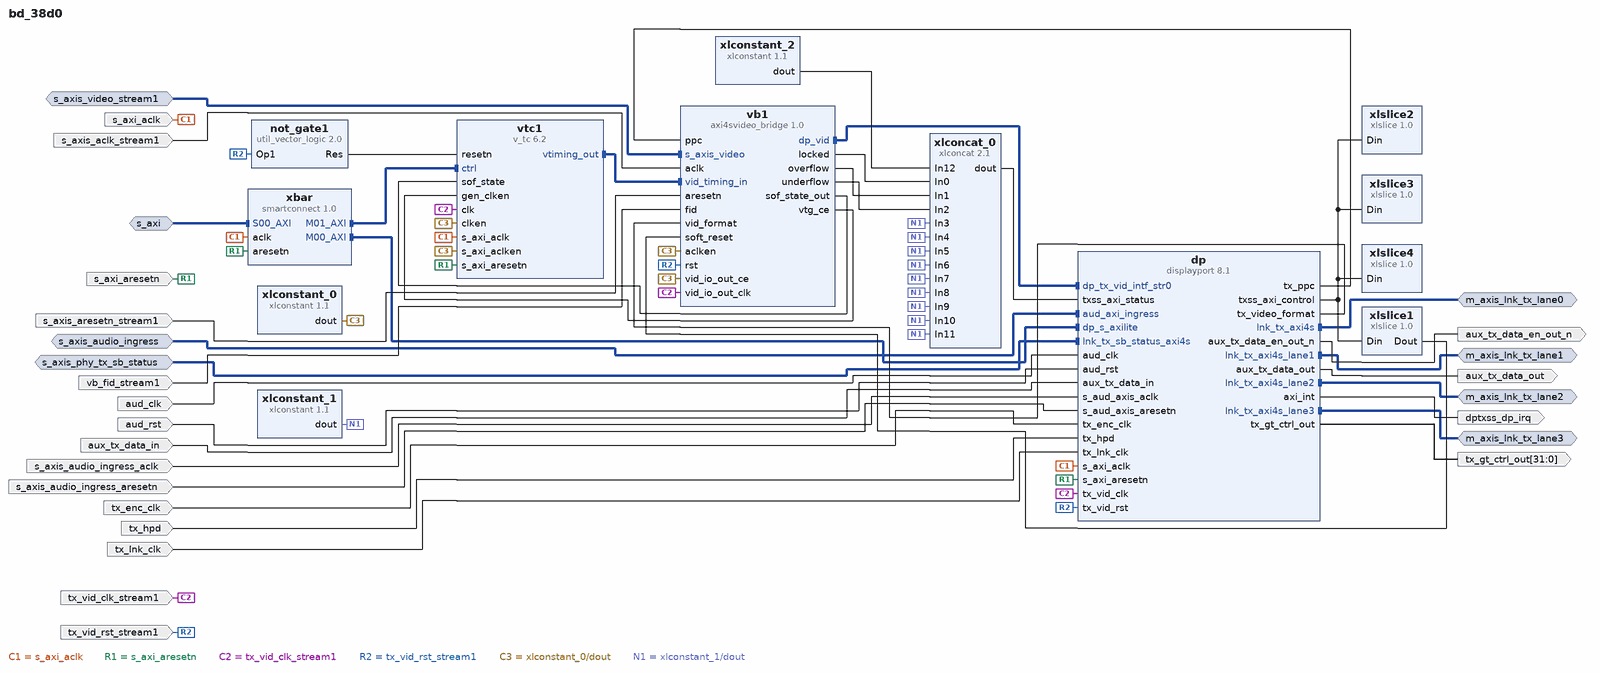
[diagram p0: block diagram of the top level]
# Vivado block design bd_38d0, xcvc1902-vsva2197-2MP-e-S, Vivado 2023.2
create_bd_design bd_38d0

create_bd_intf_port -mode Slave -vlnv xilinx.com:interface:aximm_rtl:1.0 s_axi
set_property -dict [list \
  CONFIG.ADDR_WIDTH 16 \
  CONFIG.DATA_WIDTH 32 \
  CONFIG.NUM_READ_OUTSTANDING 1 \
  CONFIG.NUM_WRITE_OUTSTANDING 1 \
  CONFIG.PROTOCOL AXI4LITE \
  CONFIG.master_id 1 \
] [get_bd_intf_ports s_axi]
create_bd_intf_port -mode Slave -vlnv xilinx.com:interface:axis_rtl:1.0 s_axis_video_stream1
set_property -dict {CONFIG.HAS_TLAST 1 CONFIG.TDATA_NUM_BYTES 15} [get_bd_intf_ports s_axis_video_stream1]
create_bd_intf_port -mode Slave -vlnv xilinx.com:interface:axis_rtl:1.0 s_axis_phy_tx_sb_status
create_bd_intf_port -mode Master -vlnv xilinx.com:interface:axis_rtl:1.0 m_axis_lnk_tx_lane0
create_bd_intf_port -mode Master -vlnv xilinx.com:interface:axis_rtl:1.0 m_axis_lnk_tx_lane1
create_bd_intf_port -mode Master -vlnv xilinx.com:interface:axis_rtl:1.0 m_axis_lnk_tx_lane2
create_bd_intf_port -mode Master -vlnv xilinx.com:interface:axis_rtl:1.0 m_axis_lnk_tx_lane3
create_bd_intf_port -mode Slave -vlnv xilinx.com:interface:axis_rtl:1.0 s_axis_audio_ingress
set_property -dict {CONFIG.HAS_TLAST 1 CONFIG.TDATA_NUM_BYTES 4} [get_bd_intf_ports s_axis_audio_ingress]
create_bd_port -dir I aux_tx_data_in
create_bd_port -dir O aux_tx_data_out
create_bd_port -dir O aux_tx_data_en_out_n
create_bd_port -dir I -type data tx_hpd
create_bd_port -dir O -type intr dptxss_dp_irq
create_bd_port -dir O -from 31 -to 0 tx_gt_ctrl_out
create_bd_port -dir I vb_fid_stream1
create_bd_port -dir I -type clk s_axi_aclk
set_property -dict [list \
  CONFIG.ASSOCIATED_BUSIF s_axi:s_axis_phy_tx_sb_status \
  CONFIG.ASSOCIATED_RESET s_axi_aresetn \
] [get_bd_ports s_axi_aclk]
create_bd_port -dir I -type rst s_axi_aresetn
set_property -dict {CONFIG.POLARITY ACTIVE_LOW} [get_bd_ports s_axi_aresetn]
create_bd_port -dir I -type clk s_axis_aclk_stream1
set_property -dict [list \
  CONFIG.ASSOCIATED_BUSIF s_axis_video_stream1 \
  CONFIG.ASSOCIATED_RESET s_axis_aresetn_stream1 \
] [get_bd_ports s_axis_aclk_stream1]
create_bd_port -dir I -type rst s_axis_aresetn_stream1
set_property -dict {CONFIG.POLARITY ACTIVE_LOW} [get_bd_ports s_axis_aresetn_stream1]
create_bd_port -dir I -type clk tx_vid_clk_stream1
set_property -dict {CONFIG.ASSOCIATED_RESET tx_vid_rst_stream1} [get_bd_ports tx_vid_clk_stream1]
create_bd_port -dir I -type rst tx_vid_rst_stream1
set_property -dict {CONFIG.POLARITY ACTIVE_HIGH} [get_bd_ports tx_vid_rst_stream1]
create_bd_port -dir I -type clk tx_enc_clk
create_bd_port -dir I -type clk tx_lnk_clk
set_property -dict [list \
  CONFIG.ASSOCIATED_BUSIF m_axis_lnk_tx_lane0:m_axis_lnk_tx_lane1:m_axis_lnk_tx_lane2:m_axis_lnk_tx_lane3 \
] [get_bd_ports tx_lnk_clk]
create_bd_port -dir I aud_clk
create_bd_port -dir I aud_rst
create_bd_port -dir I -type clk s_axis_audio_ingress_aclk
set_property -dict [list \
  CONFIG.ASSOCIATED_BUSIF s_axis_audio_ingress \
  CONFIG.ASSOCIATED_RESET s_axis_audio_ingress_aresetn \
] [get_bd_ports s_axis_audio_ingress_aclk]
create_bd_port -dir I -type rst s_axis_audio_ingress_aresetn
set_property -dict {CONFIG.POLARITY ACTIVE_LOW} [get_bd_ports s_axis_audio_ingress_aresetn]

create_bd_cell -type ip -vlnv xilinx.com:ip:displayport:8.1 dp
set_property -dict [list \
  CONFIG.C_VERSAL true \
  CONFIG.ENABLE_8B10B_ENC true \
  CONFIG.Enable_HDCP22_Encryption_Hooks false \
  CONFIG.Enable_HDCP_Encryption_Hooks false \
  CONFIG.Enable_of_Audio_Channels true \
  CONFIG.GT_Data_Width 2 \
  CONFIG.Link_Rate 8.1 \
  CONFIG.MST_Enable false \
  CONFIG.Max_Bits_Per_Color 10 \
  CONFIG.Number_of_Audio_Channels 2 \
  CONFIG.Number_of_Lanes 4 \
  CONFIG.PHY_type_External External_phy \
  CONFIG.Protocol_Selection DP_1_3 \
  CONFIG.Quad_Pixel_Enable true \
  CONFIG.SIM_Mode false \
  CONFIG.SS_Mode true \
  CONFIG.YCRCB_Enable true \
  CONFIG.YOnly_Enable true \
  CONFIG.YUV420_ENABLE 0 \
  CONFIG.aux_io_loc 1 \
  CONFIG.aux_io_type 0 \
  CONFIG.eDP_Enable false \
] [get_bd_cells dp]
create_bd_cell -type ip -vlnv xilinx.com:ip:xlconstant:1.1 xlconstant_1
set_property -dict {CONFIG.CONST_VAL 0} [get_bd_cells xlconstant_1]
create_bd_cell -type ip -vlnv xilinx.com:ip:xlconcat:2.1 xlconcat_0
set_property -dict {CONFIG.IN12_WIDTH 20 CONFIG.NUM_PORTS 13} [get_bd_cells xlconcat_0]
create_bd_cell -type ip -vlnv xilinx.com:ip:xlconstant:1.1 xlconstant_0
create_bd_cell -type ip -vlnv xilinx.com:ip:xlconstant:1.1 xlconstant_2
set_property -dict {CONFIG.CONST_VAL 0 CONFIG.CONST_WIDTH 20} [get_bd_cells xlconstant_2]
create_bd_cell -type ip -vlnv xilinx.com:ip:xlslice:1.0 xlslice1
set_property -dict {CONFIG.DIN_FROM 31 CONFIG.DIN_TO 31 CONFIG.DIN_WIDTH 32} [get_bd_cells xlslice1]
create_bd_cell -type ip -vlnv xilinx.com:ip:xlslice:1.0 xlslice2
set_property -dict {CONFIG.DIN_FROM 30 CONFIG.DIN_TO 30 CONFIG.DIN_WIDTH 32} [get_bd_cells xlslice2]
create_bd_cell -type ip -vlnv xilinx.com:ip:xlslice:1.0 xlslice3
set_property -dict {CONFIG.DIN_FROM 29 CONFIG.DIN_TO 29 CONFIG.DIN_WIDTH 32} [get_bd_cells xlslice3]
create_bd_cell -type ip -vlnv xilinx.com:ip:xlslice:1.0 xlslice4
set_property -dict {CONFIG.DIN_FROM 28 CONFIG.DIN_TO 28 CONFIG.DIN_WIDTH 32} [get_bd_cells xlslice4]
create_bd_cell -type ip -vlnv xilinx.com:ip:v_tc:6.2 vtc1
set_property -dict [list \
  CONFIG.GEN_FIELDID_EN true \
  CONFIG.GEN_FIELDID_POLARITY Low \
  CONFIG.INTERLACE_EN true \
  CONFIG.VIDEO_MODE 480p \
  CONFIG.enable_detection false \
  CONFIG.max_clocks_per_line 16384 \
  CONFIG.max_lines_per_frame 8192 \
] [get_bd_cells vtc1]
create_bd_cell -type ip -vlnv xilinx.com:ip:util_vector_logic:2.0 not_gate1
set_property -dict {CONFIG.C_OPERATION not CONFIG.C_SIZE 1} [get_bd_cells not_gate1]
create_bd_cell -type ip -vlnv xilinx.com:ip:smartconnect:1.0 xbar
set_property -dict {CONFIG.NUM_MI 2 CONFIG.NUM_SI 1} [get_bd_cells xbar]
create_bd_cell -type ip -vlnv xilinx.com:ip:axi4svideo_bridge:1.0 vb1
set_property -dict [list \
  CONFIG.pBPC 10 \
  CONFIG.pENABLE_420 0 \
  CONFIG.pENABLE_DSC false \
  CONFIG.pINPUT_PIXELS_PER_CLOCK 4 \
  CONFIG.pPIXELS_PER_CLOCK 4 \
  CONFIG.pPPC_CONVERT_EN 1 \
  CONFIG.pTDATA_NUM_BYTES 120 \
  CONFIG.pUG934_COMPLIANCE true \
] [get_bd_cells vb1]

# ---- connections ----

connect_bd_intf_net [get_bd_intf_pins dp/lnk_tx_axi4s] [get_bd_intf_ports m_axis_lnk_tx_lane0]
connect_bd_intf_net [get_bd_intf_pins dp/lnk_tx_axi4s_lane1] [get_bd_intf_ports m_axis_lnk_tx_lane1]
connect_bd_intf_net [get_bd_intf_pins dp/lnk_tx_axi4s_lane2] [get_bd_intf_ports m_axis_lnk_tx_lane2]
connect_bd_intf_net [get_bd_intf_pins dp/lnk_tx_axi4s_lane3] [get_bd_intf_ports m_axis_lnk_tx_lane3]
connect_bd_intf_net [get_bd_intf_ports s_axi] [get_bd_intf_pins xbar/S00_AXI]
connect_bd_intf_net [get_bd_intf_ports s_axis_audio_ingress] [get_bd_intf_pins dp/aud_axi_ingress]
connect_bd_intf_net [get_bd_intf_pins dp/lnk_tx_sb_status_axi4s] [get_bd_intf_ports s_axis_phy_tx_sb_status]
connect_bd_intf_net -intf_net s_axis_video_stream1_1 [get_bd_intf_ports s_axis_video_stream1] [get_bd_intf_pins vb1/s_axis_video]
connect_bd_intf_net [get_bd_intf_pins vb1/dp_vid] [get_bd_intf_pins dp/dp_tx_vid_intf_str0]
connect_bd_intf_net [get_bd_intf_pins vb1/vid_timing_in] [get_bd_intf_pins vtc1/vtiming_out]
connect_bd_intf_net [get_bd_intf_pins xbar/M00_AXI] [get_bd_intf_pins dp/dp_s_axilite]
connect_bd_intf_net [get_bd_intf_pins xbar/M01_AXI] [get_bd_intf_pins vtc1/ctrl]
connect_bd_net [get_bd_ports aud_clk] [get_bd_pins dp/aud_clk]
connect_bd_net [get_bd_ports aud_rst] [get_bd_pins dp/aud_rst]
connect_bd_net [get_bd_ports aux_tx_data_in] [get_bd_pins dp/aux_tx_data_in]
connect_bd_net [get_bd_pins dp/aux_tx_data_en_out_n] [get_bd_ports aux_tx_data_en_out_n]
connect_bd_net [get_bd_pins dp/aux_tx_data_out] [get_bd_ports aux_tx_data_out]
connect_bd_net [get_bd_pins dp/axi_int] [get_bd_ports dptxss_dp_irq]
connect_bd_net [get_bd_pins dp/tx_gt_ctrl_out] [get_bd_ports tx_gt_ctrl_out]
connect_bd_net [get_bd_pins dp/tx_ppc] [get_bd_pins vb1/ppc]
connect_bd_net [get_bd_pins dp/tx_video_format] [get_bd_pins vb1/vid_format]
connect_bd_net [get_bd_pins dp/txss_axi_control] \
  [get_bd_pins xlslice1/Din] [get_bd_pins xlslice2/Din] [get_bd_pins xlslice3/Din] [get_bd_pins xlslice4/Din]
connect_bd_net [get_bd_pins not_gate1/Res] [get_bd_pins vtc1/resetn]
connect_bd_net [get_bd_ports s_axi_aclk] [get_bd_pins dp/s_axi_aclk] [get_bd_pins vtc1/s_axi_aclk] [get_bd_pins xbar/aclk]
connect_bd_net [get_bd_ports s_axi_aresetn] [get_bd_pins dp/s_axi_aresetn] [get_bd_pins vtc1/s_axi_aresetn] [get_bd_pins xbar/aresetn]
connect_bd_net -net s_axis_aclk_stream1_1 [get_bd_ports s_axis_aclk_stream1] [get_bd_pins vb1/aclk]
connect_bd_net -net s_axis_aresetn_stream1_1 [get_bd_ports s_axis_aresetn_stream1] [get_bd_pins vb1/aresetn]
connect_bd_net [get_bd_ports s_axis_audio_ingress_aclk] [get_bd_pins dp/s_aud_axis_aclk]
connect_bd_net [get_bd_ports s_axis_audio_ingress_aresetn] [get_bd_pins dp/s_aud_axis_aresetn]
connect_bd_net [get_bd_ports tx_enc_clk] [get_bd_pins dp/tx_enc_clk]
connect_bd_net [get_bd_ports tx_hpd] [get_bd_pins dp/tx_hpd]
connect_bd_net [get_bd_ports tx_lnk_clk] [get_bd_pins dp/tx_lnk_clk]
connect_bd_net -net tx_vid_clk_stream1_1 [get_bd_ports tx_vid_clk_stream1] \
  [get_bd_pins dp/tx_vid_clk] [get_bd_pins vtc1/clk] [get_bd_pins vb1/vid_io_out_clk]
connect_bd_net -net tx_vid_rst_stream1_1 [get_bd_ports tx_vid_rst_stream1] \
  [get_bd_pins not_gate1/Op1] [get_bd_pins vb1/rst] [get_bd_pins dp/tx_vid_rst]
connect_bd_net [get_bd_pins vb1/locked] [get_bd_pins xlconcat_0/In0]
connect_bd_net [get_bd_pins vb1/overflow] [get_bd_pins xlconcat_0/In1]
connect_bd_net [get_bd_pins vb1/sof_state_out] [get_bd_pins vtc1/sof_state]
connect_bd_net [get_bd_pins vb1/underflow] [get_bd_pins xlconcat_0/In2]
connect_bd_net [get_bd_pins vb1/vtg_ce] [get_bd_pins vtc1/gen_clken]
connect_bd_net -net vb_fid_stream1_1 [get_bd_ports vb_fid_stream1] [get_bd_pins vb1/fid]
connect_bd_net [get_bd_pins xlconcat_0/dout] [get_bd_pins dp/txss_axi_status]
connect_bd_net [get_bd_pins xlconstant_0/dout] \
  [get_bd_pins vb1/aclken] [get_bd_pins vb1/vid_io_out_ce] [get_bd_pins vtc1/clken] [get_bd_pins vtc1/s_axi_aclken]
connect_bd_net [get_bd_pins xlconstant_1/dout] \
  [get_bd_pins xlconcat_0/In3] [get_bd_pins xlconcat_0/In4] [get_bd_pins xlconcat_0/In5] [get_bd_pins xlconcat_0/In6] \
  [get_bd_pins xlconcat_0/In7] [get_bd_pins xlconcat_0/In8] [get_bd_pins xlconcat_0/In9] [get_bd_pins xlconcat_0/In10] \
  [get_bd_pins xlconcat_0/In11]
connect_bd_net [get_bd_pins xlconstant_2/dout] [get_bd_pins xlconcat_0/In12]
connect_bd_net [get_bd_pins xlslice1/Dout] [get_bd_pins vb1/soft_reset]

# ---- address map ----
assign_bd_address -offset 0x0000 -range 8K -target_address_space [get_bd_addr_spaces s_axi] [get_bd_addr_segs dp/dp_s_axilite/Reg]
assign_bd_address -offset 0x8000 -range 4K -target_address_space [get_bd_addr_spaces s_axi] [get_bd_addr_segs vtc1/ctrl/Reg]

validate_bd_design
save_bd_design
